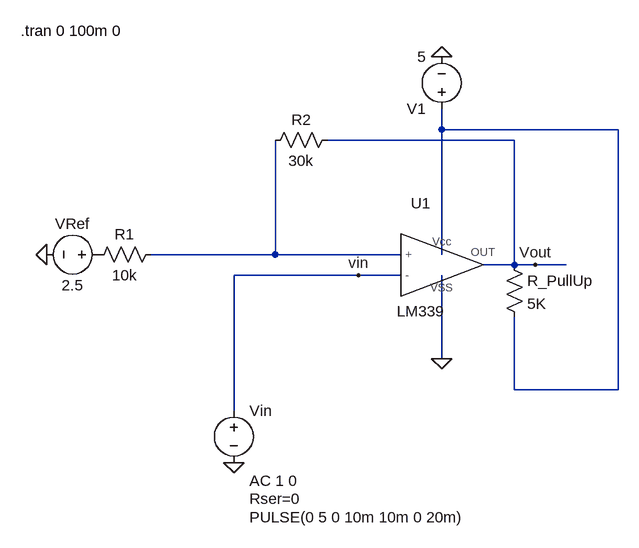
[diagram p0: schematic BAI 3 CHUAN BI 3.asc]
BAI 3 CHUAN BI 3.asc, the LTspice schematic file:
Version 4.1
SHEET 1 880 680
WIRE 208 -64 208 -96
WIRE 480 -64 208 -64
WIRE 320 -48 32 -48
WIRE -48 128 -48 -48
WIRE -48 128 -240 128
WIRE 144 128 -48 128
WIRE 208 128 208 -64
WIRE 320 144 320 -48
WIRE 320 144 272 144
WIRE 352 144 320 144
WIRE 400 144 352 144
WIRE 80 160 -112 160
WIRE 144 160 80 160
WIRE 208 288 208 160
WIRE 320 336 320 224
WIRE 480 336 480 -64
WIRE 480 336 320 336
WIRE -112 368 -112 160
FLAG 352 144 Vout
FLAG -400 128 0
FLAG -112 448 0
FLAG 208 -176 0
FLAG 80 160 vin
FLAG 208 288 0
SYMBOL LM339 176 144 R0
SYMATTR InstName U1
SYMBOL res 48 -64 R90
WINDOW 0 0 56 VBottom 2
WINDOW 3 32 56 VTop 2
SYMATTR InstName R2
SYMATTR Value 30k
SYMBOL res -224 112 R90
WINDOW 0 0 56 VBottom 2
WINDOW 3 32 56 VTop 2
SYMATTR InstName R1
SYMATTR Value 10k
SYMBOL voltage -304 128 R90
WINDOW 0 -32 56 VBottom 2
WINDOW 3 32 56 VTop 2
SYMATTR InstName VRef
SYMATTR Value 2.5
SYMBOL voltage -112 352 R0
WINDOW 3 24 180 Left 2
WINDOW 123 24 124 Left 2
WINDOW 39 24 152 Left 2
SYMATTR Value PULSE(0 5 0 10m 10m 0 20m)
SYMATTR Value2 AC 1 0
SYMATTR SpiceLine Rser=0
SYMATTR InstName Vin
SYMBOL voltage 208 -80 R180
WINDOW 123 0 0 Left 0
WINDOW 39 0 0 Left 0
SYMATTR InstName V1
SYMATTR Value 5
SYMBOL res 304 128 R0
SYMATTR InstName R_PullUp
SYMATTR Value 5K
TEXT -440 -216 Left 2 !.tran 0 100m 0

The netlist it stands for:
* BAI 3 CHUAN BI 3.asc
X§U1 N002 vin N001 0 Vout LM339  ; pins + - Vcc VSS OUT
R2 Vout N002 30k
R1 N002 P001 10k
VRef P001 0 2.5
Vin vin 0 PULSE(0 5 0 10m 10m 0 20m) AC 1 0 Rser=0
V1 N001 0 5
R_PullUp Vout N001 5K
.tran 0 100m 0
.lib E:\ThiThucHanhCoHa\CoHa\LM339.cir
.backanno
.end